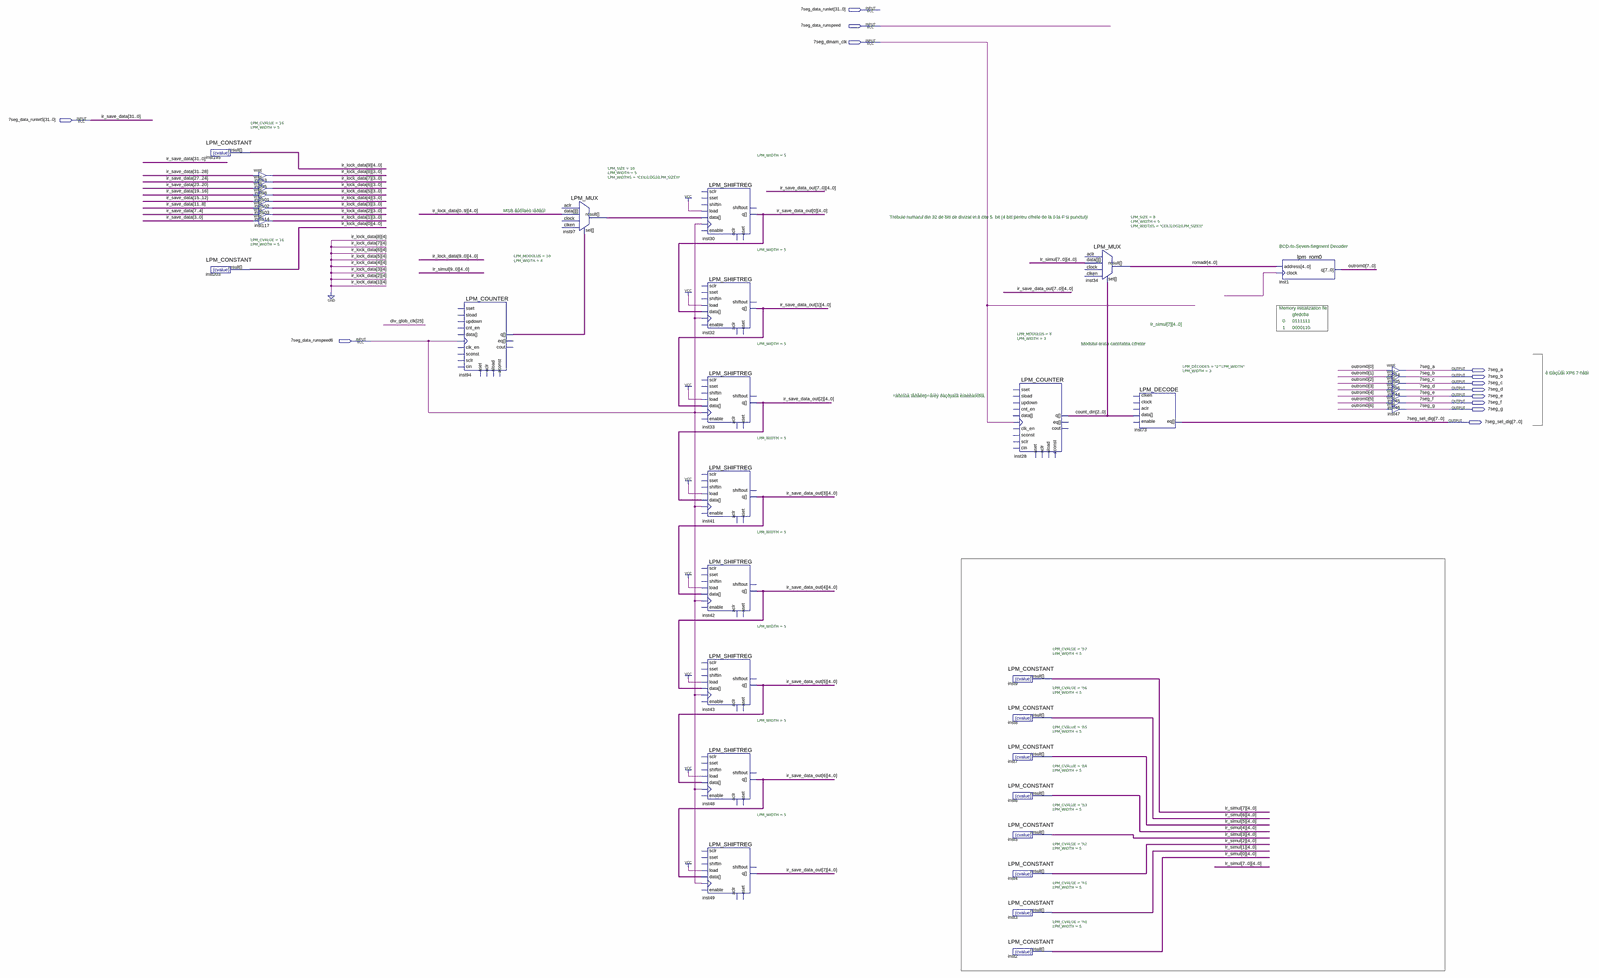
[diagram p0: schematic sheet, whole]
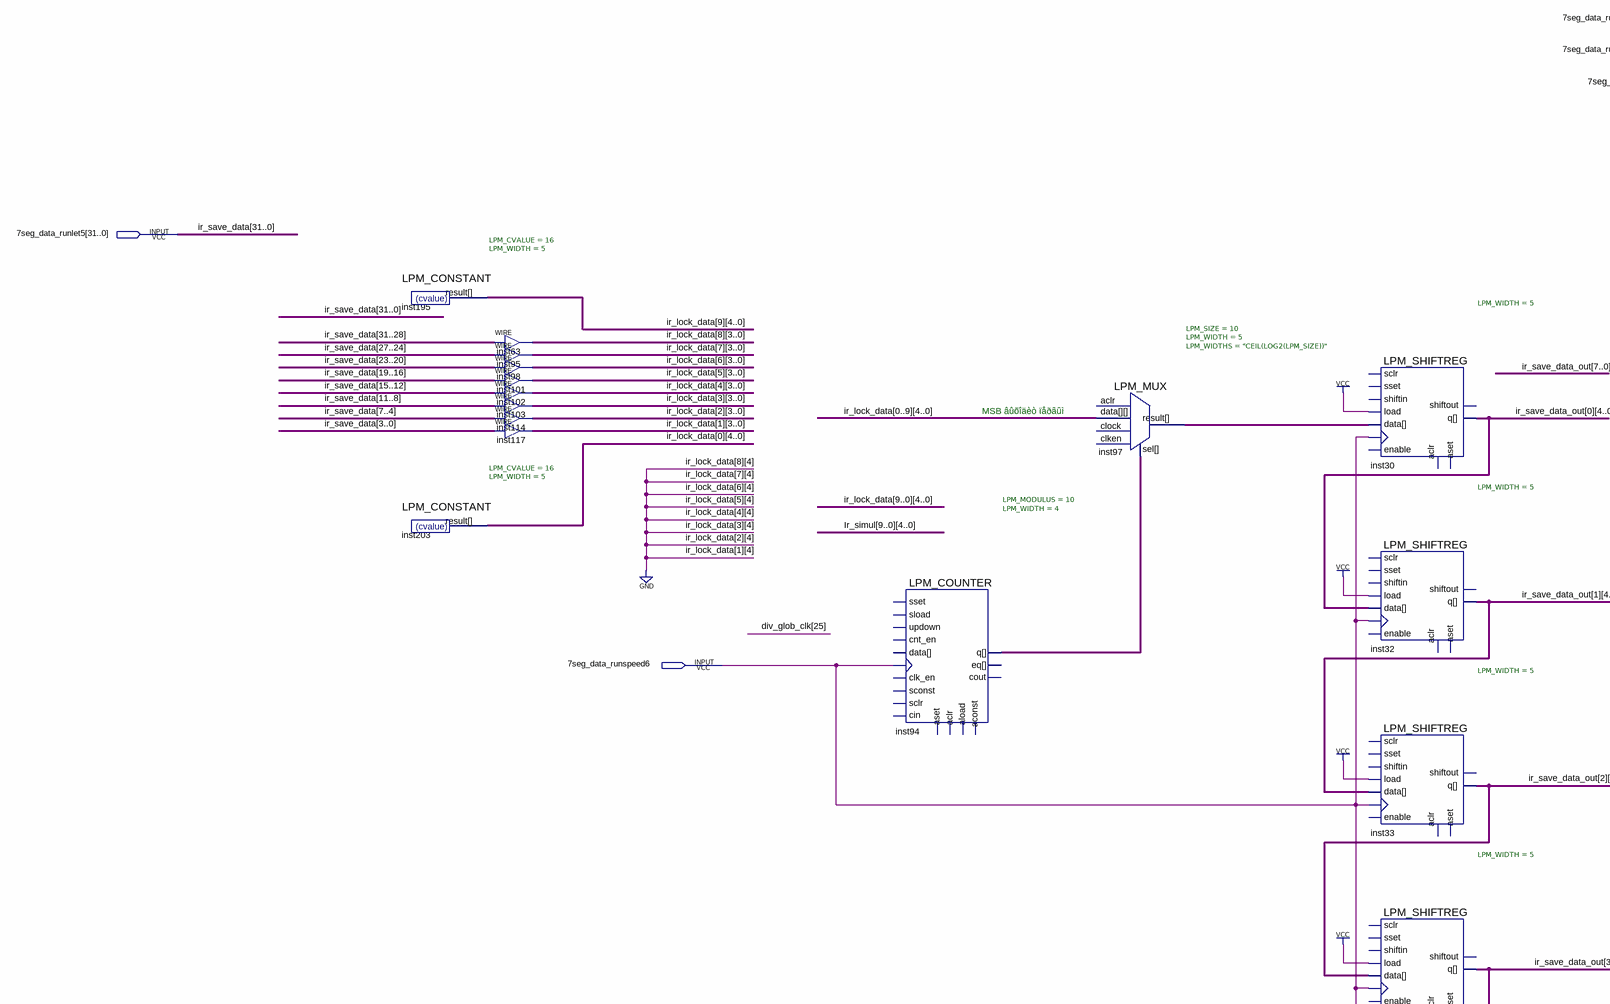
[diagram p1: schematic sheet, upper left part]
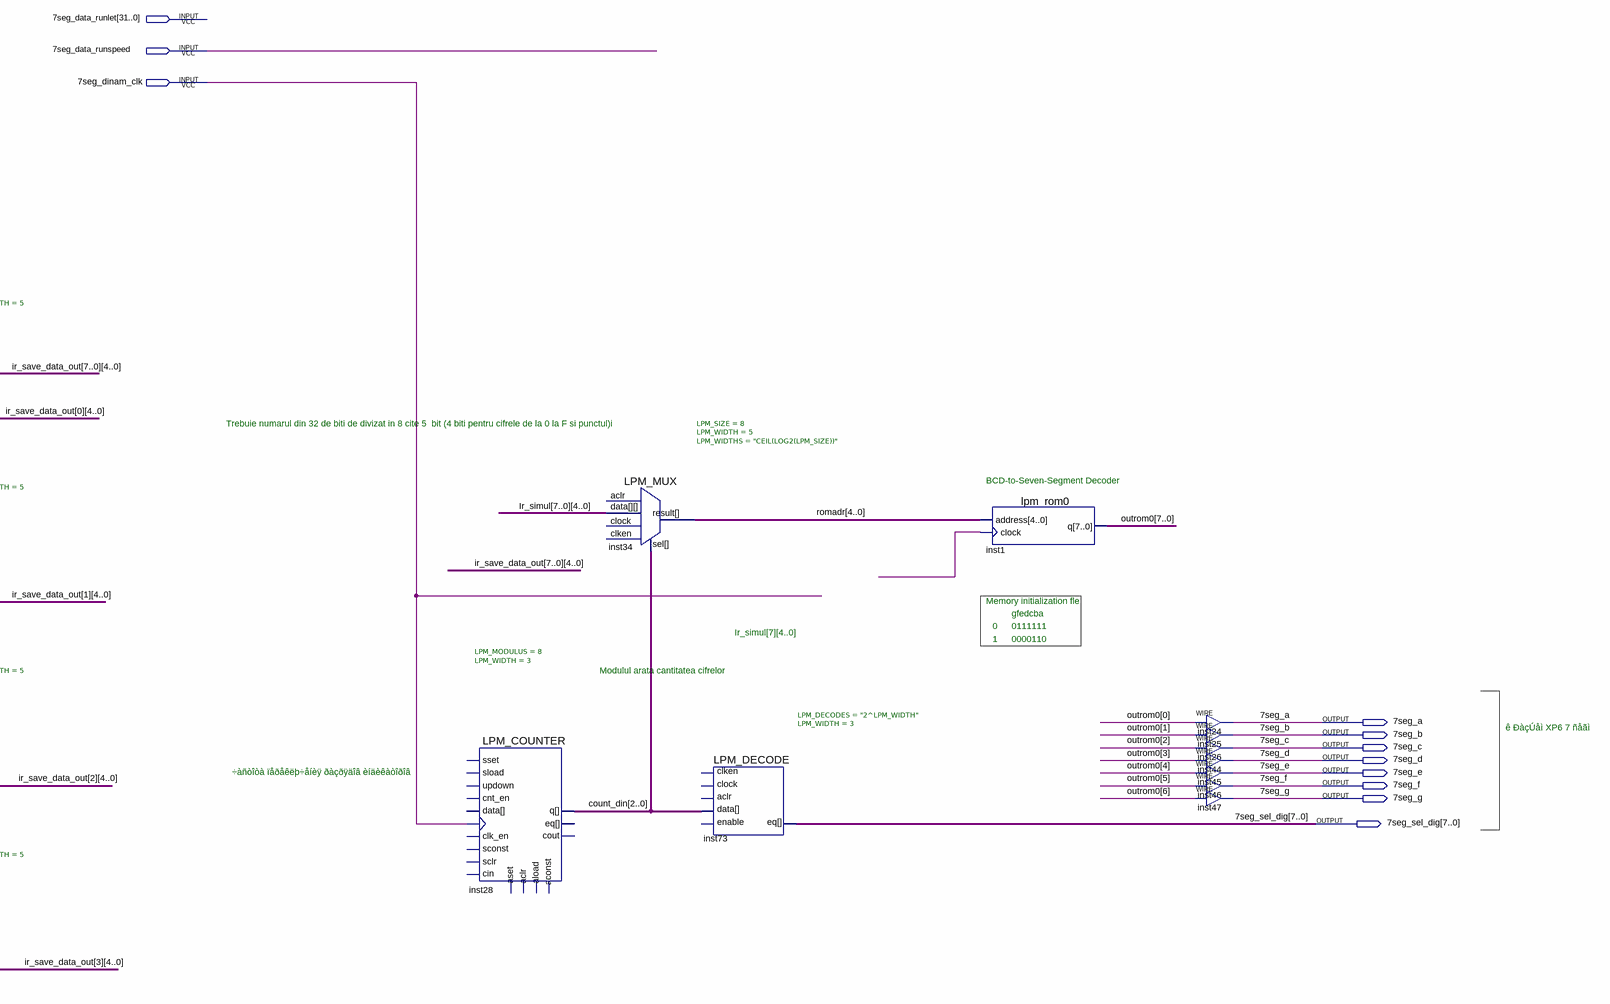
[diagram p2: schematic sheet, upper right part]
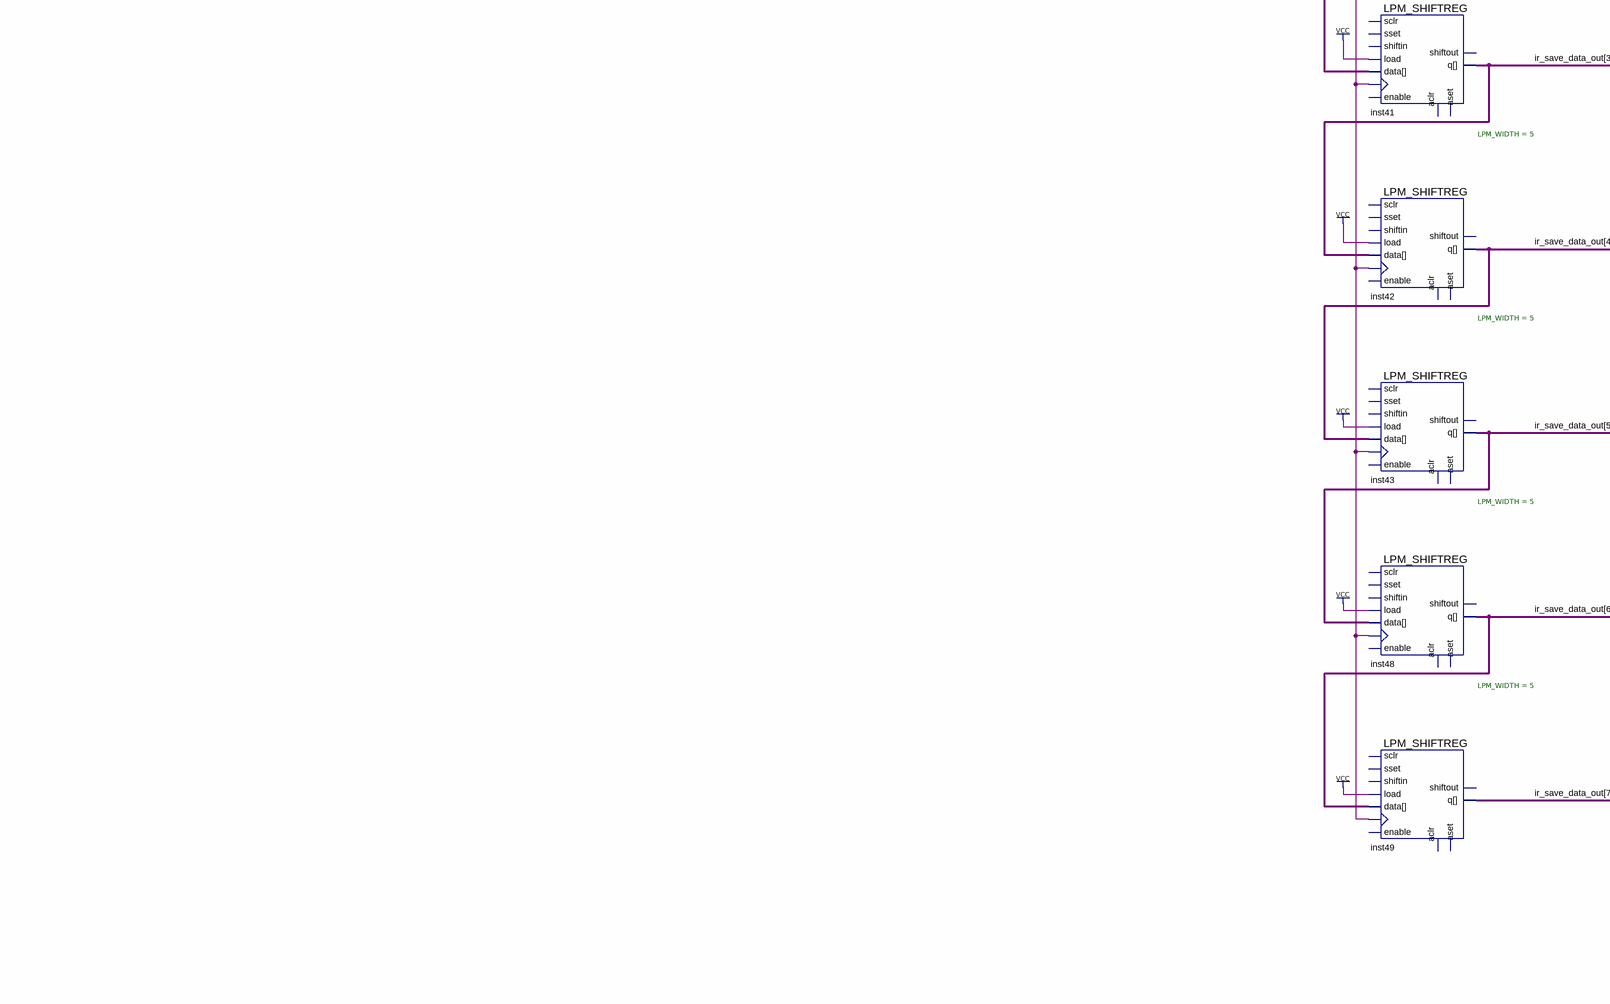
[diagram p3: schematic sheet, lower left part]
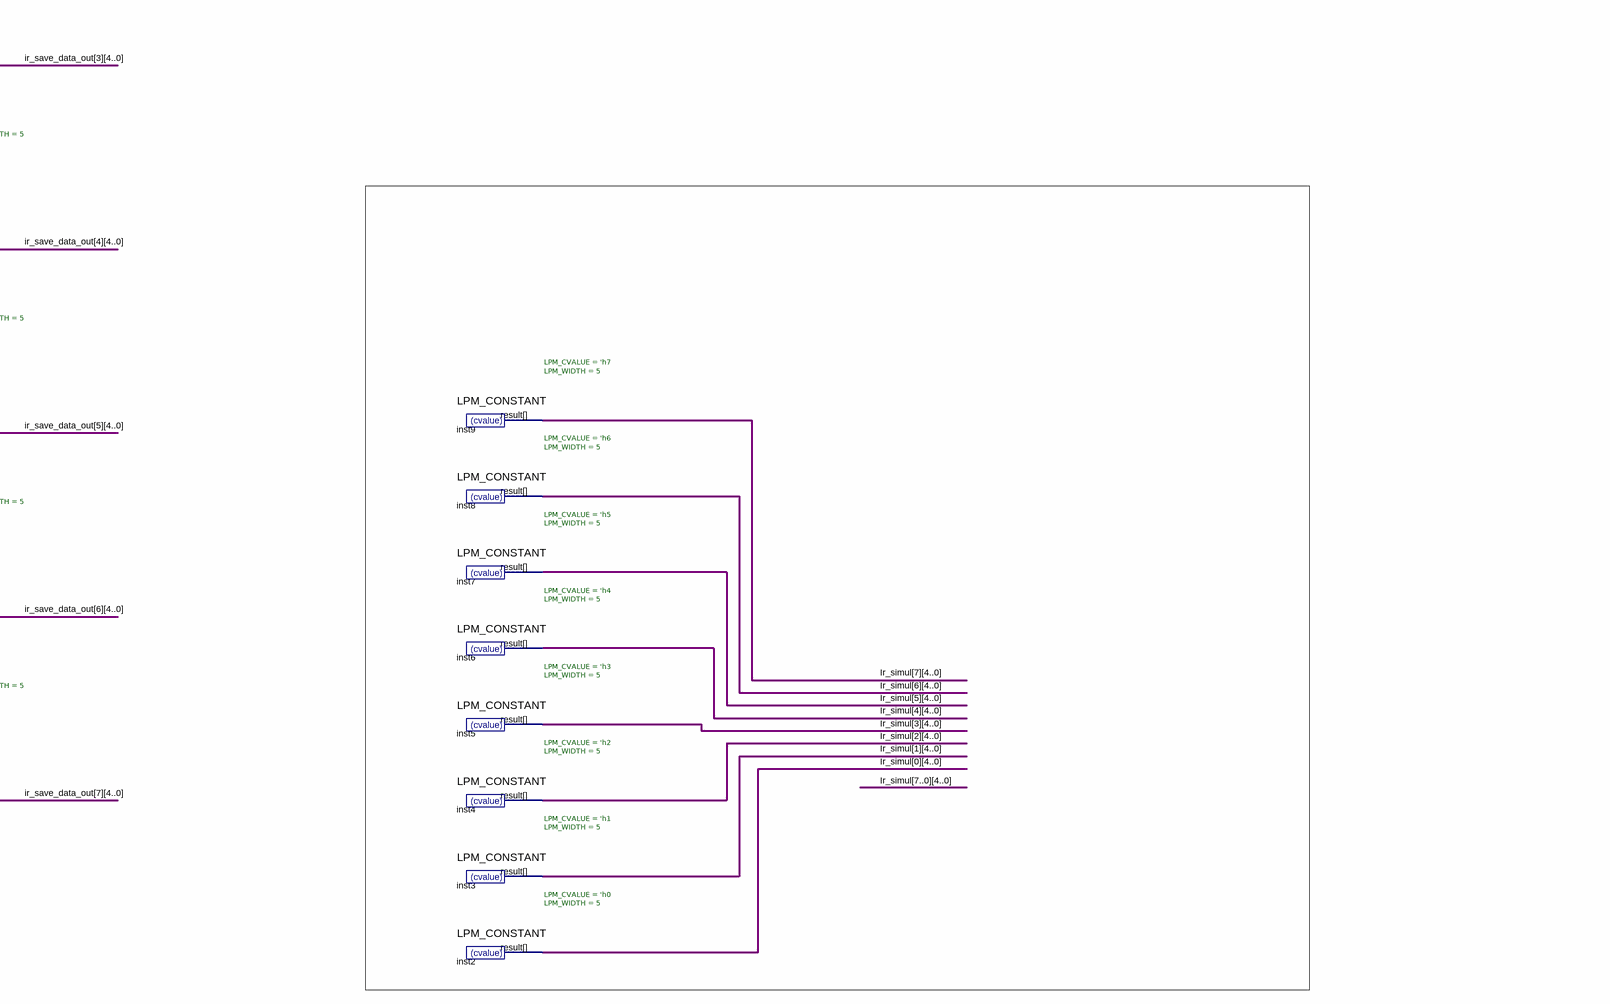
[diagram p4: schematic sheet, lower right part]
// Quartus schematic sss_7seg.bdf as structural Verilog: 39 symbols, 13 pins
module sss_7seg (
  input  [31:0] \7seg_data_runlet ,
  input  \7seg_data_runspeed ,
  input  \7seg_dinam_clk ,
  input  [31:0] \7seg_data_runlet5 ,
  input  \7seg_data_runspeed6 ,
  output \7seg_a ,
  output \7seg_b ,
  output \7seg_c ,
  output \7seg_d ,
  output \7seg_e ,
  output \7seg_f ,
  output \7seg_g ,
  output [7:0] \7seg_sel_dig 
);

  wire undriven;
  wire [2:0] count_din;
  wire [3:0] inst94_q, ir_lock_data_1, ir_lock_data_2, ir_lock_data_3, ir_lock_data_4, ir_lock_data_5,
       ir_lock_data_6, ir_lock_data_7, ir_lock_data_8;
  wire [4:0] inst97_result, ir_lock_data_0, ir_lock_data_9, ir_save_data_out_0, ir_save_data_out_1,
       ir_save_data_out_2, ir_save_data_out_3, ir_save_data_out_4, ir_save_data_out_5, ir_save_data_out_6,
       ir_save_data_out_7, Ir_simul_0, Ir_simul_1, Ir_simul_2, Ir_simul_3, Ir_simul_4, Ir_simul_5,
       Ir_simul_6, Ir_simul_7, romadr;
  wire [7:0] outrom0;

  LPM_CONSTANT #(.LPM_CVALUE(16), .LPM_WIDTH(5)) inst195 (.result(ir_lock_data_9));
  LPM_CONSTANT #(.LPM_CVALUE(16), .LPM_WIDTH(5)) inst203 (.result(ir_lock_data_0));
  assign ir_lock_data_8 = \7seg_data_runlet5 [31:28];  // WIRE inst63
  assign ir_lock_data_7 = \7seg_data_runlet5 [27:24];  // WIRE inst95
  assign ir_lock_data_6 = \7seg_data_runlet5 [23:20];  // WIRE inst98
  assign ir_lock_data_5 = \7seg_data_runlet5 [19:16];  // WIRE inst101
  assign ir_lock_data_4 = \7seg_data_runlet5 [15:12];  // WIRE inst102
  assign ir_lock_data_3 = \7seg_data_runlet5 [11:8];  // WIRE inst103
  assign ir_lock_data_2 = \7seg_data_runlet5 [7:4];  // WIRE inst114
  assign ir_lock_data_1 = \7seg_data_runlet5 [3:0];  // WIRE inst117
  LPM_COUNTER #(.LPM_MODULUS(10), .LPM_WIDTH(4)) inst94 (
    .clock(\7seg_data_runspeed6 ), .q(inst94_q));  // open: sset, sload, updown, cnt_en, data, clk_en, sconst, sclr, aload, aclr, aset, aconst, cin, eq, cout
  LPM_MUX #(.LPM_SIZE(10), .LPM_WIDTH(5), .LPM_WIDTHS("CEIL(LOG2(LPM_SIZE))")) inst97 (
    .data({ir_lock_data_0, 1'b0, ir_lock_data_1, 1'b0, ir_lock_data_2, 1'b0, ir_lock_data_3, 1'b0, ir_lock_data_4, 1'b0, ir_lock_data_5, 1'b0, ir_lock_data_6, 1'b0, ir_lock_data_7, 1'b0, ir_lock_data_8, ir_lock_data_9}),
    .sel(inst94_q), .result(inst97_result));  // open: clock, aclr, clken
  LPM_SHIFTREG #(.LPM_WIDTH(5)) inst30 (
    .clock(\7seg_data_runspeed6 ), .data(inst97_result), .load(1'b1), .q(ir_save_data_out_0));  // open: shiftin, sset, enable, sclr, aset, aclr, shiftout
  LPM_SHIFTREG #(.LPM_WIDTH(5)) inst32 (
    .clock(\7seg_data_runspeed6 ), .data(ir_save_data_out_0), .load(1'b1), .q(ir_save_data_out_1));  // open: shiftin, sset, enable, sclr, aset, aclr, shiftout
  LPM_SHIFTREG #(.LPM_WIDTH(5)) inst33 (
    .clock(\7seg_data_runspeed6 ), .data(ir_save_data_out_1), .load(1'b1), .q(ir_save_data_out_2));  // open: shiftin, sset, enable, sclr, aset, aclr, shiftout
  LPM_SHIFTREG #(.LPM_WIDTH(5)) inst41 (
    .clock(\7seg_data_runspeed6 ), .data(ir_save_data_out_2), .load(1'b1), .q(ir_save_data_out_3));  // open: shiftin, sset, enable, sclr, aset, aclr, shiftout
  LPM_SHIFTREG #(.LPM_WIDTH(5)) inst42 (
    .clock(\7seg_data_runspeed6 ), .data(ir_save_data_out_3), .load(1'b1), .q(ir_save_data_out_4));  // open: shiftin, sset, enable, sclr, aset, aclr, shiftout
  LPM_SHIFTREG #(.LPM_WIDTH(5)) inst43 (
    .clock(\7seg_data_runspeed6 ), .data(ir_save_data_out_4), .load(1'b1), .q(ir_save_data_out_5));  // open: shiftin, sset, enable, sclr, aset, aclr, shiftout
  LPM_SHIFTREG #(.LPM_WIDTH(5)) inst48 (
    .clock(\7seg_data_runspeed6 ), .data(ir_save_data_out_5), .load(1'b1), .q(ir_save_data_out_6));  // open: shiftin, sset, enable, sclr, aset, aclr, shiftout
  LPM_SHIFTREG #(.LPM_WIDTH(5)) inst49 (
    .clock(\7seg_data_runspeed6 ), .data(ir_save_data_out_6), .load(1'b1), .q(ir_save_data_out_7));  // open: shiftin, sset, enable, sclr, aset, aclr, shiftout
  LPM_CONSTANT #(.LPM_CVALUE('h7), .LPM_WIDTH(5)) inst9 (.result(Ir_simul_7));
  LPM_CONSTANT #(.LPM_CVALUE('h6), .LPM_WIDTH(5)) inst8 (.result(Ir_simul_6));
  LPM_CONSTANT #(.LPM_CVALUE('h5), .LPM_WIDTH(5)) inst7 (.result(Ir_simul_5));
  LPM_CONSTANT #(.LPM_CVALUE('h4), .LPM_WIDTH(5)) inst6 (.result(Ir_simul_4));
  LPM_CONSTANT #(.LPM_CVALUE('h3), .LPM_WIDTH(5)) inst5 (.result(Ir_simul_3));
  LPM_CONSTANT #(.LPM_CVALUE('h2), .LPM_WIDTH(5)) inst4 (.result(Ir_simul_2));
  LPM_CONSTANT #(.LPM_CVALUE('h1), .LPM_WIDTH(5)) inst3 (.result(Ir_simul_1));
  LPM_CONSTANT #(.LPM_CVALUE('h0), .LPM_WIDTH(5)) inst2 (.result(Ir_simul_0));
  LPM_COUNTER #(.LPM_MODULUS(8), .LPM_WIDTH(3)) inst28 (
    .clock(\7seg_dinam_clk ), .q(count_din));  // open: sset, sload, updown, cnt_en, data, clk_en, sconst, sclr, aload, aclr, aset, aconst, cin, eq, cout
  LPM_MUX #(.LPM_SIZE(8), .LPM_WIDTH(5), .LPM_WIDTHS("CEIL(LOG2(LPM_SIZE))")) inst34 (
    .data({Ir_simul_7, Ir_simul_6, Ir_simul_5, Ir_simul_4, Ir_simul_3, Ir_simul_2, Ir_simul_1, Ir_simul_0}),
    .sel(count_din), .result(romadr));  // open: clock, aclr, clken
  LPM_DECODE #(.LPM_DECODES("2^LPM_WIDTH"), .LPM_WIDTH(3)) inst73 (
    .data(count_din), .eq(\7seg_sel_dig ));  // open: enable, clken, clock, aclr
  lpm_rom0 inst1 (.address(romadr), .clock(undriven), .q(outrom0));
  assign \7seg_a  = outrom0[0];  // WIRE inst24
  assign \7seg_b  = outrom0[1];  // WIRE inst25
  assign \7seg_c  = outrom0[2];  // WIRE inst26
  assign \7seg_d  = outrom0[3];  // WIRE inst44
  assign \7seg_e  = outrom0[4];  // WIRE inst45
  assign \7seg_f  = outrom0[5];  // WIRE inst46
  assign \7seg_g  = outrom0[6];  // WIRE inst47

  // Other names for the same wires on the sheet: ir_save_data[31:0] = \7seg_data_runlet5 

  // Notes on the sheet:
  //   MSB âûõîäèò ïåðâûì
  //   Trebuie numarul din 32 de biti de divizat in 8 cite 5  bit (4 biti pentru cifrele de la 0 la F si punctul)i
  //   BCD-to-Seven-Segment Decoder
  //   Memory initialization fle
  //   gfedcba
  //   0
  //   0111111
  //   Ir_simul[7][4..0]
  //   1
  //   0000110
  //   Modulul arata cantitatea cifrelor
  //   ê ÐàçÚåì XP6 7 ñåãì
  //   ÷àñòîòà ïåðåêëþ÷åíèÿ ðàçðÿäîâ èíäèêàòîðîâ
endmodule
